# Altium schematic sheet Sensor.SchDoc
size A4; SheetNumber: 2; SheetTotal: 2; SheetSize: A4
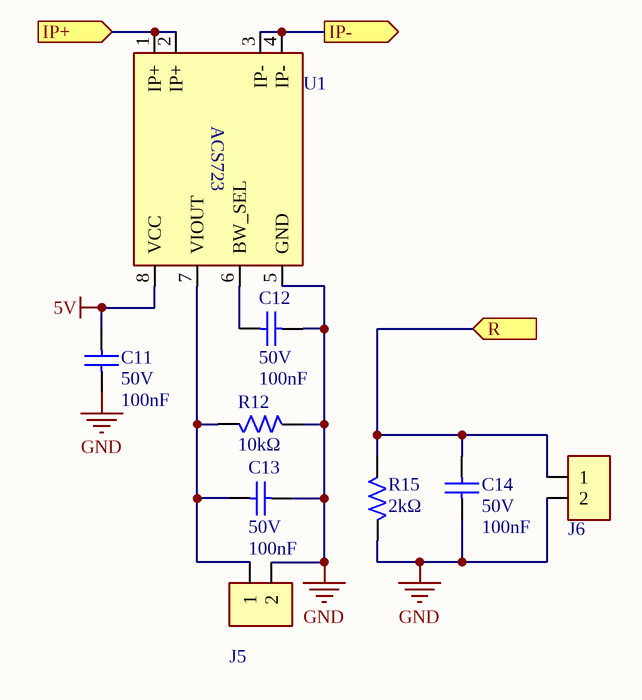
[diagram p0: Sensor.SchDoc]

## Parts
?  (no value)  (graphical)
C11  Voltage Rating: 50V  Capacitance: 100nF  [CAP-0603-IPC]  (hidden comment: CL10B104KB8NNWC)
C12  Voltage Rating: 50V  Capacitance: 100nF  [CAP-0603-IPC]  (hidden comment: CL10B104KB8NNWC)
C13  Voltage Rating: 50V  Capacitance: 100nF  [CAP-0603-IPC]  (hidden comment: CL10B104KB8NNWC)
C14  Voltage Rating: 50V  Capacitance: 100nF  [CAP-0603-IPC]  (hidden comment: CL10B104KB8NNWC)
J5  B2B-XH-A  [HDR 2 POS 2.5mm ST M TH_B2B-XH-A]  (value not drawn)
J6  B2B-XH-A  [HDR 2 POS 2.5mm ST M TH_B2B-XH-A]  (value not drawn)
R12  value 10kΩ  [RES-0603-IPC]  (hidden comment: RK73H1JTTD1002F)
R15  value 2kΩ  [RES-0603-IPC]  (hidden comment: RC0603DR-072KL)
U1  ACS723LLCTR-05AB-T  [SOIC-8, SO-8]  (value not drawn)

## Ports
IP+ (in, see Top_Sheet[1B]), IP- (out, see Top_Sheet[1B]), R (in, see Top_Sheet[1B])

## Nets
5V: C11.1 U1.8(VCC)
GND: C11.2 C12.1 C13.1 C14.1 J5.2 J6.2 R12.1 R15.1 U1.5(GND)
IP+: U1.1(IP+) U1.2(IP+) ; port IP+
IP-: U1.3(IP-) U1.4(IP-) ; port IP-
R: C14.2 J6.1 R15.2 ; port R
NetC12_2: C12.2 U1.6(BW_SEL)
NetC13_2: C13.2 J5.1 R12.2 U1.7(VIOUT)

## Notes on the sheet
- Title:
- Size:
- Reviewed By:
- Project Name:
- Company:
- Drawn By:
- Revision:
- Date:
- Time:
- Project:
- Sheet:
- of
- (in symbol IC Current Sensor 5A Hall Effect SOIC-8_ACS723LLCTR-05AB-T) ACS723

## Library data of the parts
? = Title Block
C11-C14 = Cap 100nF 50V X7R 0603(1608) 10% MLCC_CL10B104KB8NNWC: CAP CER 0.1UF 50V X7R 0603; Manufacturer: Samsung; Tolerance: 10%; Supplier 1: Digi-Key; Manufacturer Part Number: CL10B104KB8NNWC; RoHS: Yes; Category: Ceramic Capacitors; Stock 1: 12481520; Pricing 1: 1=0.10000, 10=0.01900, 50=0.01020, 100=0.00830, 500=0.00594, 1000=0.00467 (USD); Case/Package: 0603; Min Operating Temperature: -55°C; Max Operating Temperature: 125°C; Length: 0.063inch; Width: 0.031inch; Thickness: 0.035inch; RoHS Compliant: Yes; Supplier 2: Mouser; Stock 2: 1032910; Pricing 2: 1=0.1, 10=0.011, 50=0.011, 100=0.006, 1000=0.005, 10000=0.003 (USD); Supplier Part Number 1: 1276-1935-1-ND; Supplier Part Number 2: 187-CL10B104KB8NNWC; ComponentLink2Description: Digikey; ComponentLink2URL: https://www.digikey.com/en/products/detail/samsung-electro-mechanics/CL10B104KB8NNWC/3887593; ComponentLink3Description: DataSheet; ComponentLink3URL: https://media.digikey.com/pdf/Data%20Sheets/Samsung%20PDFs/CL10B104KB8NNWC_Spec.pdf; Mount: Surface Mount; Case Code (Metric): 1608; Case Code (Imperial): 0603; Contact Plating: Tin; Package Quantity: 1; Packaging: Cut Tape; Dielectric: X7R; Termination: Wraparound; Series: CL; Construction: Flat; ComponentLink4Description: Mouser; ComponentLink4URL: https://eu.mouser.com/ProductDetail/Samsung-Electro-Mechanics/CL10B104KB8NNWC?qs=EvNa9vf1TdYOAZGBJN%252BGRQ%3D%3D
J5 J6 = HDR/Conn 2 POS 2.5mm TH Male_B2B-XH-A: Board Connector, 2 Contact(s), 1 Row(s), Male, Straight, Solder Terminal,; Manufacturer: JST; Supplier 1: Digi-Key; Manufacturer Part Number: B2B-XH-A; RoHS: Yes; Category: FFC / FPC; Stock 1: 1122126; Pricing 1: 1=0.15, 10=0.122, 100=0.0898, 500=0.07432, 1000=0.06502, 5000=0.05573, 10000=0.05419 (USD); Supplier Part Number 1: 455-B2B-XH-A-ND; ComponentLink1Description: DataSheet; ComponentLink1URL: https://www.jst-mfg.com/product/pdf/eng/eXH.pdf; ComponentLink2Description: Digikey; ComponentLink2URL: https://www.digikey.com/en/products/detail/jst-sales-america-inc/B2B-XH-A/1651045
R12 = Res 10kΩ 0603(1608) 1% 0.1W_RK73H1JTTD1002F: Resistor Thick Film 0603 10K Ohm 1% 1/10W ±100ppm/°C SMD Punched Paper Tape and Reel; Manufacturer: KOA Speer; Power Rating: 100mW; Voltage Rating: 50V; Supplier 1: Digi-Key; Manufacturer Part Number: RK73H1JTTD1002F; RoHS: Yes; Category: Chip SMD Resistors; Stock 1: 3368554; Pricing 1: 1=0.1, 10=0.026, 100=0.0105, 1000=0.00472, 2500=0.0041 (USD); Case/Package: 0603; Case Code (Imperial): 0603; Case Code (Metric): 1608; Min Operating Temperature: -55°C; Max Operating Temperature: 155°C; Resistor Type: Thick Film; Tolerance: 1%; Temperature Coefficient: 100ppm/°C; Packaging: Tape and Reel; Termination: SMD/SMT; Features: Moisture Resistant,Automotive AEC-Q200; Series: RK73H; Max Power Dissipation: 100mW; Number of Terminations: 2; Resistance Tolerance: 1%; Construction: Rectangular; Length: 1.6mm; Width: 0.8mm; Height: 0.45mm; Depth: 0.8mm; RoHS Compliant: Yes; Military Standard: Not; Reach SVHC Compliant: Unknown; Lead Free: Lead Free; Supplier 2: Mouser; Stock 2: 680823; Pricing 2: 1=0.1, 10=0.013, 50=0.013, 100=0.008, 1000=0.005, 10000=0.004 (USD); Supplier Part Number 1: 2019-RK73H1JTTD1002FCT-ND; Supplier Part Number 2: 660-RK73H1JTTD1002F; ComponentLink2Description: DataSheet; ComponentLink2URL: https://www.koaspeer.com/pdfs/RK73H.pdf; Pins: 2; Package Quantity: 5000; Voltage Rating (DC): 50V; Ratings: AEC-Q200; ComponentLink4Description: Digikey; ComponentLink4URL: https://www.digikey.com/en/products/detail/koa-speer-electronics-inc/RK73H1JTTD1002F/9844954; ComponentLink5Description: Mouser; ComponentLink5URL: https://eu.mouser.com/ProductDetail/KOA-Speer/RK73H1JTTD1002F?qs=%252BHd4ebZ%252Bq6V15kIYdKv25A%3D%3D
R15 = Res 2kΩ 0603(1608) 0.5% 0.1W RC0603DR-072KL: 2 kOhms ±0.5% 0.1W, 1/10W Chip Resistor 0603 (1608 Metric) Moisture Resistant Thick Film; Manufacturer: Yageo; Max Power Dissipation: 100mW; Temperature Coefficient: 100ppm/°C; Supplier 1: Digi-Key; Manufacturer Part Number: RC0603DR-072KL; RoHS: Yes; Category: Chip SMD Resistors; Stock 1: 24993; Pricing 1: 1=0.1, 10=0.034, 50=0.0222, 100=0.0187, 500=0.01302, 1000=0.01133 (USD); Supplier Part Number 1: 13-RC0603DR-072KLCT-ND; ComponentLink1Description: DataSheet; ComponentLink1URL: https://www.yageo.com/upload/media/product/productsearch/datasheet/rchip/PYu-RC_Group_51_RoHS_L_12.pdf; ComponentLink2Description: Digikey; ComponentLink2URL: https://www.digikey.com/en/products/detail/yageo/RC0603DR-072KL/5917988; Case/Package: 0603; Min Operating Temperature: -55°C; Max Operating Temperature: 155°C; Packaging: Tape and Reel; Number of Terminations: 2; Tolerance: 0.5%; Features: Moisture Resistant; Series: RC; Length: 0.063inch; Width: 0.031inch; Height: 0.022inch; RoHS Compliant: Yes
U1 = IC Current Sensor 5A Hall Effect SOIC-8_ACS723LLCTR-05AB-T: High Accuracy, Galvanically Isolated Current Sensor IC With Small Footprint SOIC8 Package; Manufacturer: Allegro MicroSystems; Bandwidth: 80kHz; Supplier 1: Digikey; Manufacturer Part Number: ACS723LLCTR-05AB-T; RoHS: Yes; Category: Current Sensors; Stock 1: 6267; Pricing 1: 1=5.54, 5=4.668, 10=4.337, 25=3.936, 50=3.6574, 100=3.3989, 500=2.86738, 1000=2.66503 (USD); Height: 1.75mm; RoHS Compliant: 5897YesNo; Supplier 2: Mouser; Stock 2: 27382; Pricing 2: 1=4.67, 10=3.65, 50=3.65, 100=3.4, 1000=2.67, 10000=2.39 (USD); Supplier Part Number 1: 620-1641-1-ND; Supplier Part Number 2: 250-723LLCTR05ABT; ComponentLink1Description: DataSheet; ComponentLink1URL: https://www.allegromicro.com/~/media/Files/Datasheets/ACS723-Datasheet.ashx; ComponentLink2Description: Digikey; ComponentLink2URL: https://www.digikey.com/en/products/detail/allegro-microsystems/ACS723LLCTR-05AB-T/4915376?s=N4IgTCBcDaIGxgAwFoCMcAsq3IHIBEQBdAXyA; ComponentLink3Description: Mouser; ComponentLink3URL: https://eu.mouser.com/ProductDetail/Allegro-MicroSystems/ACS723LLCTR-05AB-T?qs=pUKx8fyJudDgZZVdH2Guaw%3D%3D